# Altium schematic sheet fpga02-serdes-power.SchDoc
size Tabloid; SheetNumber: 44; SheetTotal: 71
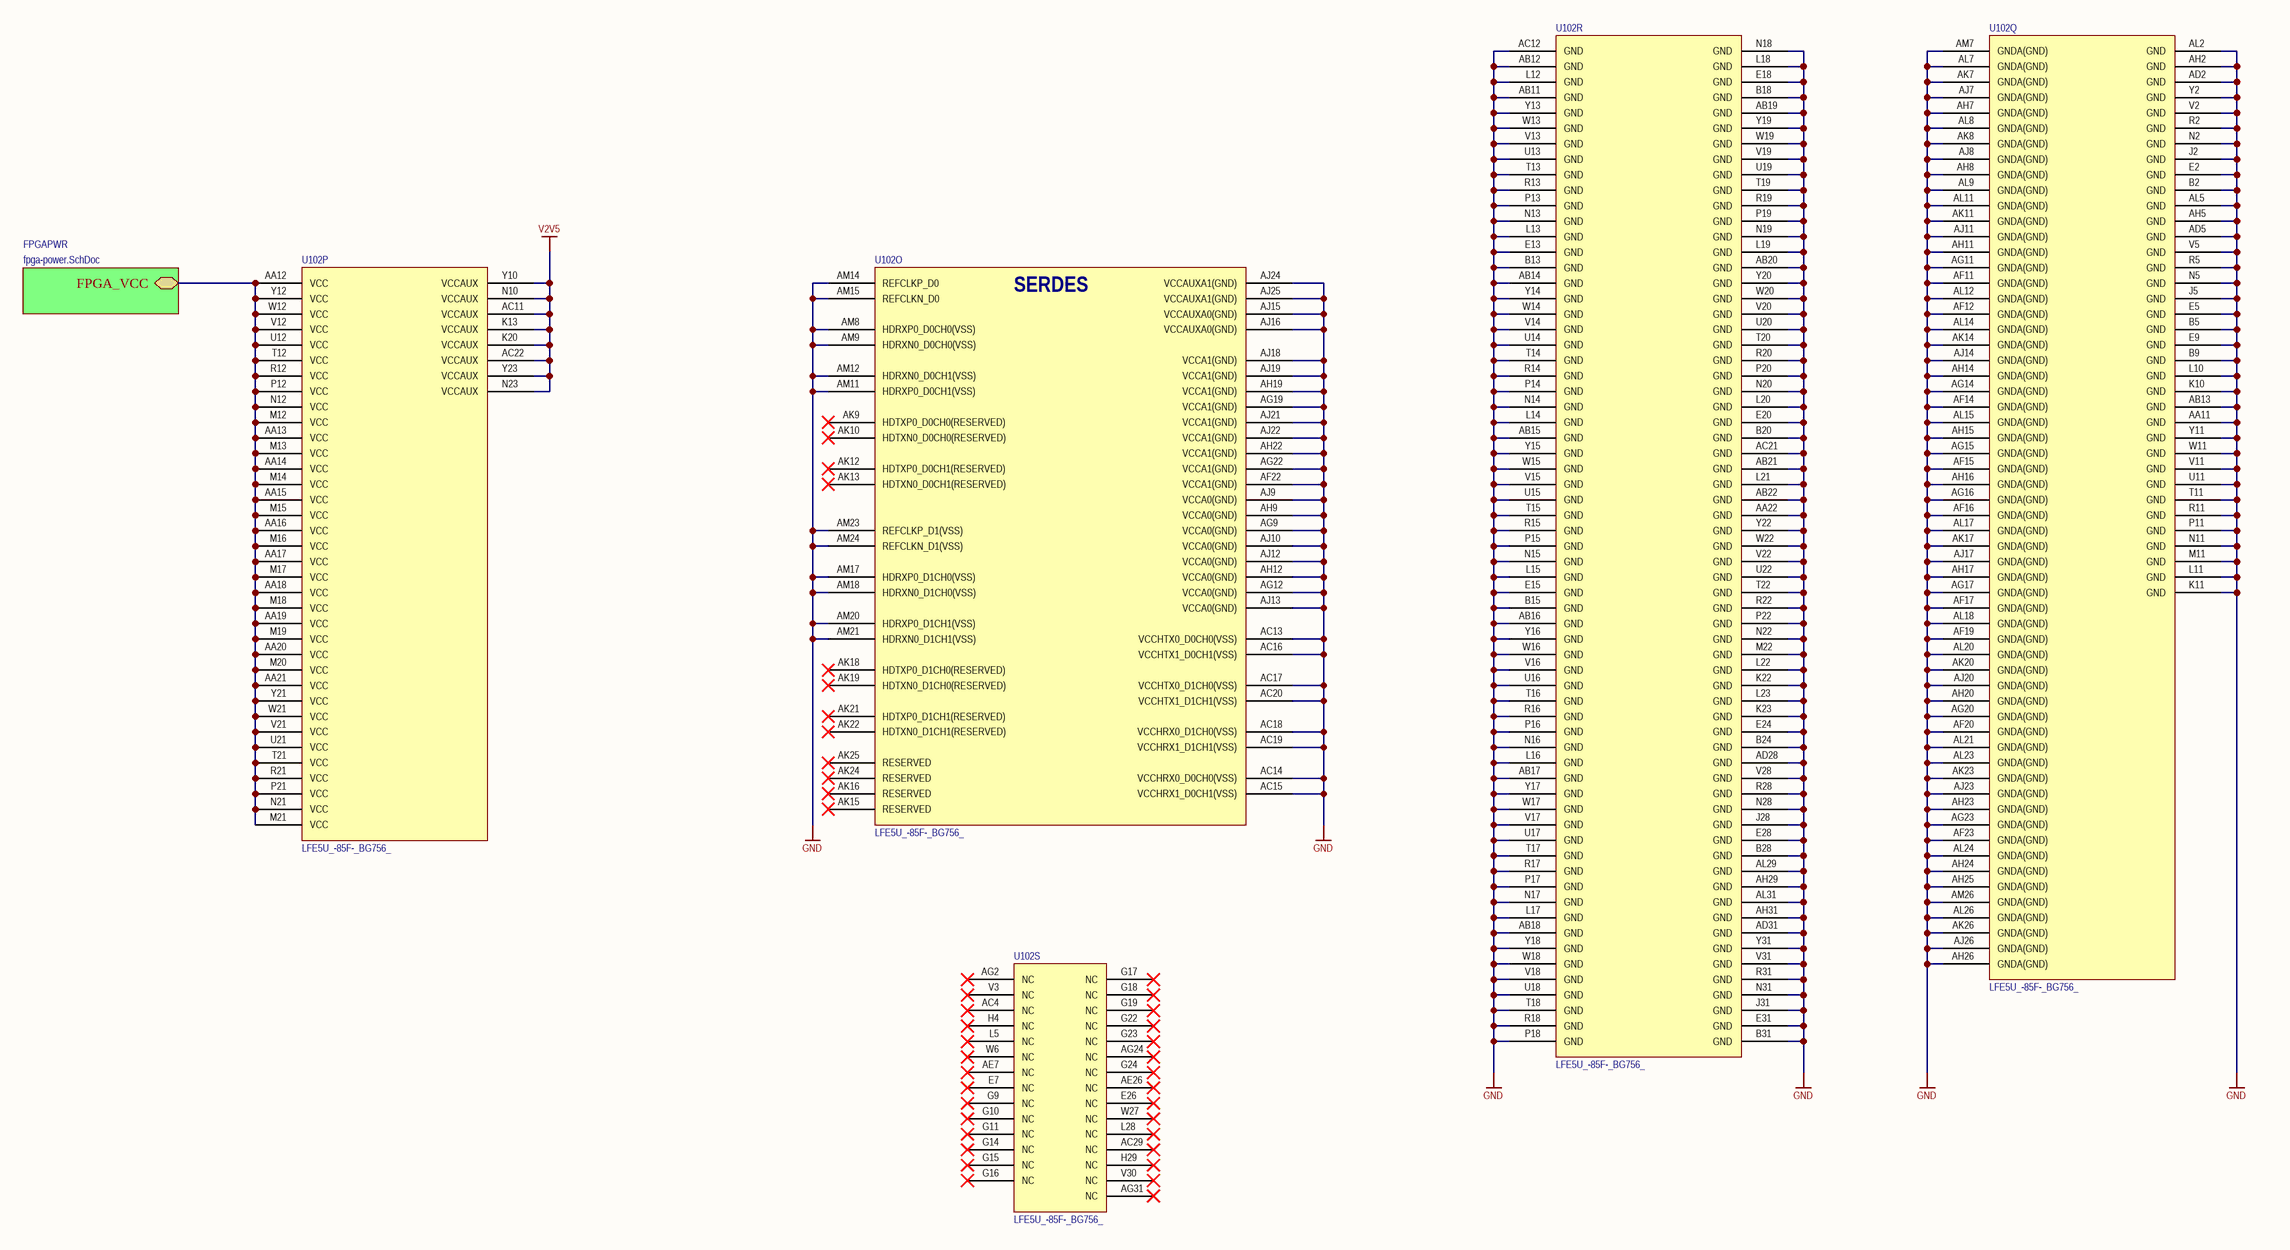
[diagram p0: fpga02-serdes-power.SchDoc]

## Parts
U102  LFE5U_-85F-_BG756_  [caBGA756]  (parts O,P,Q,R,S of 19)

## Sub-sheets
FPGAPWR = fpga-power.SchDoc: FPGA_VCC

## Nets
GND: U102.AA11(GND) U102.AA22(GND) U102.AB11(GND) U102.AB12(GND) U102.AB13(GND) U102.AB14(GND) U102.AB15(GND) U102.AB16(GND) U102.AB17(GND) U102.AB18(GND) U102.AB19(GND) U102.AB20(GND) U102.AB21(GND) U102.AB22(GND) U102.AC12(GND) U102.AC13(VCCHTX0_D0CH0(VSS)) U102.AC14(VCCHRX0_D0CH0(VSS)) U102.AC15(VCCHRX1_D0CH1(VSS)) U102.AC16(VCCHTX1_D0CH1(VSS)) U102.AC17(VCCHTX0_D1CH0(VSS)) U102.AC18(VCCHRX0_D1CH0(VSS)) U102.AC19(VCCHRX1_D1CH1(VSS)) U102.AC20(VCCHTX1_D1CH1(VSS)) U102.AC21(GND) U102.AD2(GND) U102.AD5(GND) U102.AD28(GND) U102.AD31(GND) U102.AF11(GNDA(GND)) U102.AF12(GNDA(GND)) U102.AF14(GNDA(GND)) U102.AF15(GNDA(GND)) U102.AF16(GNDA(GND)) U102.AF17(GNDA(GND)) U102.AF19(GNDA(GND)) U102.AF20(GNDA(GND)) U102.AF22(VCCA1(GND)) U102.AF23(GNDA(GND)) U102.AG9(VCCA0(GND)) U102.AG11(GNDA(GND)) U102.AG12(VCCA0(GND)) U102.AG14(GNDA(GND)) U102.AG15(GNDA(GND)) U102.AG16(GNDA(GND)) U102.AG17(GNDA(GND)) U102.AG19(VCCA1(GND)) U102.AG20(GNDA(GND)) U102.AG22(VCCA1(GND)) U102.AG23(GNDA(GND)) U102.AH2(GND) U102.AH5(GND) U102.AH7(GNDA(GND)) U102.AH8(GNDA(GND)) U102.AH9(VCCA0(GND)) U102.AH11(GNDA(GND)) U102.AH12(VCCA0(GND)) U102.AH14(GNDA(GND)) U102.AH15(GNDA(GND)) U102.AH16(GNDA(GND)) U102.AH17(GNDA(GND)) U102.AH19(VCCA1(GND)) U102.AH20(GNDA(GND)) U102.AH22(VCCA1(GND)) U102.AH23(GNDA(GND)) U102.AH24(GNDA(GND)) U102.AH25(GNDA(GND)) U102.AH26(GNDA(GND)) U102.AH29(GND) U102.AH31(GND) U102.AJ7(GNDA(GND)) U102.AJ8(GNDA(GND)) U102.AJ9(VCCA0(GND)) U102.AJ10(VCCA0(GND)) U102.AJ11(GNDA(GND)) U102.AJ12(VCCA0(GND)) U102.AJ13(VCCA0(GND)) U102.AJ14(GNDA(GND)) U102.AJ15(VCCAUXA0(GND)) U102.AJ16(VCCAUXA0(GND)) U102.AJ17(GNDA(GND)) U102.AJ18(VCCA1(GND)) U102.AJ19(VCCA1(GND)) U102.AJ20(GNDA(GND)) U102.AJ21(VCCA1(GND)) U102.AJ22(VCCA1(GND)) U102.AJ23(GNDA(GND)) U102.AJ24(VCCAUXA1(GND)) U102.AJ25(VCCAUXA1(GND)) U102.AJ26(GNDA(GND)) U102.AK7(GNDA(GND)) U102.AK8(GNDA(GND)) U102.AK11(GNDA(GND)) U102.AK14(GNDA(GND)) U102.AK17(GNDA(GND)) U102.AK20(GNDA(GND)) U102.AK23(GNDA(GND)) U102.AK26(GNDA(GND)) U102.AL2(GND) U102.AL5(GND) U102.AL7(GNDA(GND)) U102.AL8(GNDA(GND)) U102.AL9(GNDA(GND)) U102.AL11(GNDA(GND)) U102.AL12(GNDA(GND)) U102.AL14(GNDA(GND)) U102.AL15(GNDA(GND)) U102.AL17(GNDA(GND)) U102.AL18(GNDA(GND)) U102.AL20(GNDA(GND)) U102.AL21(GNDA(GND)) U102.AL23(GNDA(GND)) U102.AL24(GNDA(GND)) U102.AL26(GNDA(GND)) U102.AL29(GND) U102.AL31(GND) U102.AM7(GNDA(GND)) U102.AM8(HDRXP0_D0CH0(VSS)) U102.AM9(HDRXN0_D0CH0(VSS)) U102.AM11(HDRXP0_D0CH1(VSS)) U102.AM12(HDRXN0_D0CH1(VSS)) U102.AM14(REFCLKP_D0) U102.AM15(REFCLKN_D0) U102.AM17(HDRXP0_D1CH0(VSS)) U102.AM18(HDRXN0_D1CH0(VSS)) U102.AM20(HDRXP0_D1CH1(VSS)) U102.AM21(HDRXN0_D1CH1(VSS)) U102.AM23(REFCLKP_D1(VSS)) U102.AM24(REFCLKN_D1(VSS)) U102.AM26(GNDA(GND)) U102.B2(GND) U102.B5(GND) U102.B9(GND) U102.B13(GND) U102.B15(GND) U102.B18(GND) U102.B20(GND) U102.B24(GND) U102.B28(GND) U102.B31(GND) U102.E2(GND) U102.E5(GND) U102.E9(GND) U102.E13(GND) U102.E15(GND) U102.E18(GND) U102.E20(GND) U102.E24(GND) U102.E28(GND) U102.E31(GND) U102.J2(GND) U102.J5(GND) U102.J28(GND) U102.J31(GND) U102.K10(GND) U102.K11(GND) U102.K22(GND) U102.K23(GND) U102.L10(GND) U102.L11(GND) U102.L12(GND) U102.L13(GND) U102.L14(GND) U102.L15(GND) U102.L16(GND) U102.L17(GND) U102.L18(GND) U102.L19(GND) U102.L20(GND) U102.L21(GND) U102.L22(GND) U102.L23(GND) U102.M11(GND) U102.M22(GND) U102.N2(GND) U102.N5(GND) U102.N11(GND) U102.N13(GND) U102.N14(GND) U102.N15(GND) U102.N16(GND) U102.N17(GND) U102.N18(GND) U102.N19(GND) U102.N20(GND) U102.N22(GND) U102.N28(GND) U102.N31(GND) U102.P11(GND) U102.P13(GND) U102.P14(GND) U102.P15(GND) U102.P16(GND) U102.P17(GND) U102.P18(GND) U102.P19(GND) U102.P20(GND) U102.P22(GND) U102.R2(GND) U102.R5(GND) U102.R11(GND) U102.R13(GND) U102.R14(GND) U102.R15(GND) U102.R16(GND) U102.R17(GND) U102.R18(GND) U102.R19(GND) U102.R20(GND) U102.R22(GND) U102.R28(GND) U102.R31(GND) U102.T11(GND) U102.T13(GND) U102.T14(GND) U102.T15(GND) U102.T16(GND) U102.T17(GND) U102.T18(GND) U102.T19(GND) U102.T20(GND) U102.T22(GND) U102.U11(GND) U102.U13(GND) U102.U14(GND) U102.U15(GND) U102.U16(GND) U102.U17(GND) U102.U18(GND) U102.U19(GND) U102.U20(GND) U102.U22(GND) U102.V2(GND) U102.V5(GND) U102.V11(GND) U102.V13(GND) U102.V14(GND) U102.V15(GND) U102.V16(GND) U102.V17(GND) U102.V18(GND) U102.V19(GND) U102.V20(GND) U102.V22(GND) U102.V28(GND) U102.V31(GND) U102.W11(GND) U102.W13(GND) U102.W14(GND) U102.W15(GND) U102.W16(GND) U102.W17(GND) U102.W18(GND) U102.W19(GND) U102.W20(GND) U102.W22(GND) U102.Y2(GND) U102.Y11(GND) U102.Y13(GND) U102.Y14(GND) U102.Y15(GND) U102.Y16(GND) U102.Y17(GND) U102.Y18(GND) U102.Y19(GND) U102.Y20(GND) U102.Y22(GND) U102.Y31(GND)
V2V5: U102.AC11(VCCAUX) U102.AC22(VCCAUX) U102.K13(VCCAUX) U102.K20(VCCAUX) U102.N10(VCCAUX) U102.N23(VCCAUX) U102.Y10(VCCAUX) U102.Y23(VCCAUX)
NetU102_AA12: U102.AA12(VCC) U102.AA13(VCC) U102.AA14(VCC) U102.AA15(VCC) U102.AA16(VCC) U102.AA17(VCC) U102.AA18(VCC) U102.AA19(VCC) U102.AA20(VCC) U102.AA21(VCC) U102.M12(VCC) U102.M13(VCC) U102.M14(VCC) U102.M15(VCC) U102.M16(VCC) U102.M17(VCC) U102.M18(VCC) U102.M19(VCC) U102.M20(VCC) U102.M21(VCC) U102.N12(VCC) U102.N21(VCC) U102.P12(VCC) U102.P21(VCC) U102.R12(VCC) U102.R21(VCC) U102.T12(VCC) U102.T21(VCC) U102.U12(VCC) U102.U21(VCC) U102.V12(VCC) U102.V21(VCC) U102.W12(VCC) U102.W21(VCC) U102.Y12(VCC) U102.Y21(VCC) ; sheet FPGAPWR/FPGA_VCC

Not connected (* = marked no-connect by the designer): U102 AC4(NC)* AC29(NC)* AE7(NC)* AE26(NC)* AG2(NC)* AG24(NC)* AG31(NC)* AK9(HDTXP0_D0CH0(RESERVED))* AK10(HDTXN0_D0CH0(RESERVED))* AK12(HDTXP0_D0CH1(RESERVED))* AK13(HDTXN0_D0CH1(RESERVED))* AK15(RESERVED)* AK16(RESERVED)* AK18(HDTXP0_D1CH0(RESERVED))* AK19(HDTXN0_D1CH0(RESERVED))* AK21(HDTXP0_D1CH1(RESERVED))* AK22(HDTXN0_D1CH1(RESERVED))* AK24(RESERVED)* AK25(RESERVED)* E7(NC)* E26(NC)* G9(NC)* G10(NC)* G11(NC)* G14(NC)* G15(NC)* G16(NC)* G17(NC)* G18(NC)* G19(NC)* G22(NC)* G23(NC)* G24(NC)* H4(NC)* H29(NC)* L5(NC)* L28(NC)* V3(NC)* V30(NC)* W6(NC)* W27(NC)*

## Notes on the sheet
- (in symbol LFE5U_-85F-_BG756_, part O) SERDES

## Library data of the parts
U102 = LFE5U_-85F-_BG756_: ECP5 FPGA, 85k LUT, 756-caBGA; Manufacturer: Lattice Semiconductor; Manufacturer P/N: LFE5U_-85F-_BG756_